# EAGLE design Solenoid Driver - Single (EAGLE 8.7.0)
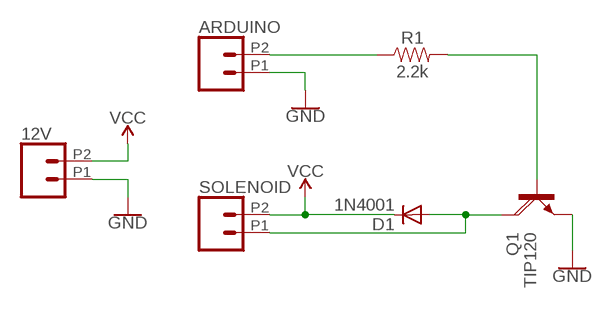
[diagram p0: schematic, sheet 1]

## Parts
12V  CONN_022.54MM_SCREWTERM  [1X02_2.54_SCREWTERM]
ARDUINO  CONN_022.54MM_SCREWTERM  [1X02_2.54_SCREWTERM]
D1  1N4001  1N4004  [DO41-10]
Q1  TIP120  [TO220AH]
R1  2.2k  10KOHM-HORIZ_KIT-1/4W-1%  [AXIAL-0.3-KIT]
SOLENOID  CONN_022.54MM_SCREWTERM  [1X02_2.54_SCREWTERM]

## Nets
GND: 12V.P1 ARDUINO.P1 Q1.E
N$1: Q1.B R1.P$2
N$2: ARDUINO.P2 R1.P$1
N$3: D1.A Q1.C SOLENOID.P1
VCC: 12V.P2 D1.C SOLENOID.P2

## Library data of the parts
12V ARDUINO SOLENOID = SparkFun-Connectors:CONN_02: Multi connection point. Often used as Generic Header-pin footprint for 0.1 inch spaced/style header connections On any of the 0.1 inch spaced packages, you can populate with these: Break Away Headers - Straight <https://www.sparkfun.com/products/116> (PRT-00116) Break Away Male Headers - Right Angle <https://www.sparkfun.com/products/553> (PRT-00553) Female Headers <https://www.sparkfun.com/products/115> (PRT-00115) Break Away Headers - Machine Pin <https://www.sparkfun.com/products/117> (PRT-00117) Break Away Female Headers - Swiss Machine Pin <https://www.sparkfun.com/products/743> (PRT-00743) For SCREWTERMINALS and SPRING TERMINALS visit here: Screw Terimnals on SparkFun.com <https://www.sparkfun.com/search/results?term=Screw+Terminals> (5mm/3.5mm/2.54mm spacing) This device is also useful as a general connection point to wire up your design to another part of your project. Our various solder wires solder well into these plated through hole pads. Hook-Up Wire - Assortment (Stranded, 22 AWG) <https://www.sparkfun.com/products/11375> (PRT-11375) Hook-Up Wire - Assortment (Solid Core, 22 AWG) <https://www.sparkfun.com/products/11367> (PRT-11367) View the entire wire category on our website here <https://www.sparkfun.com/categories/141> Special notes: Molex polarized connector foot print use with: PRT-08233 with associated crimp pins and housings. 2.54_SCREWTERM for use with PRT-10571. 3.5mm Screw Terminal footprints for PRT-08084 5mm Screw Terminal footprints for use with PRT-08432
D1 = adafruit:1N4004: DIODE General purpose 1N400x type rectifier (With bigger pads) http://www.ladyada.net/library/pcb/eaglelibrary.html
Q1 = transistor-power:TIP120: NPN DARLINGTON TRANSISTOR
R1 = SparkFun-Resistors:10KOHM: 10kΩ resistor A resistor is a passive two-terminal electrical component that implements electrical resistance as a circuit element. Resistors act to reduce current flow, and, at the same time, act to lower voltage levels within circuits. - Wikipedia; PROD_ID: RES-12183; VALUE: 10k

## Board
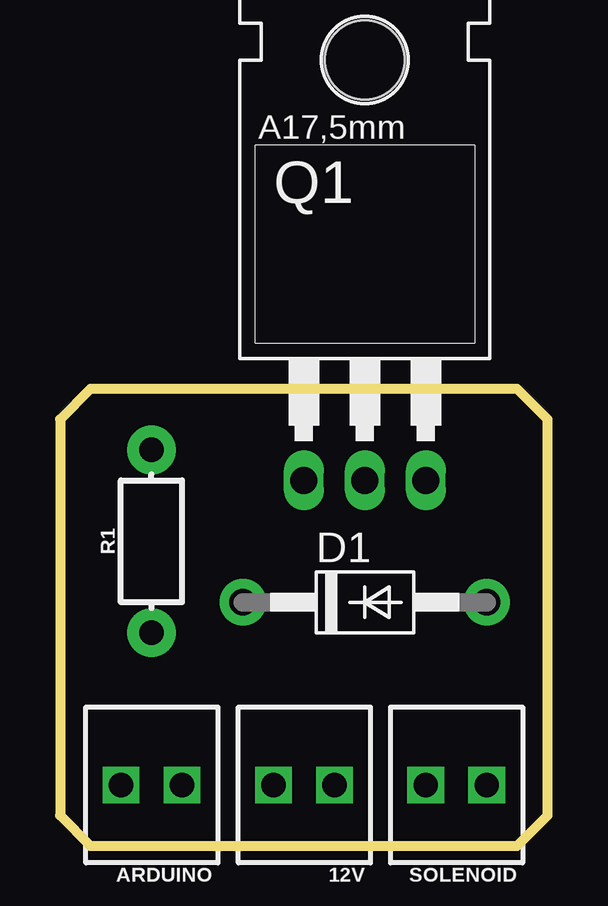
[diagram p1: board, top side]
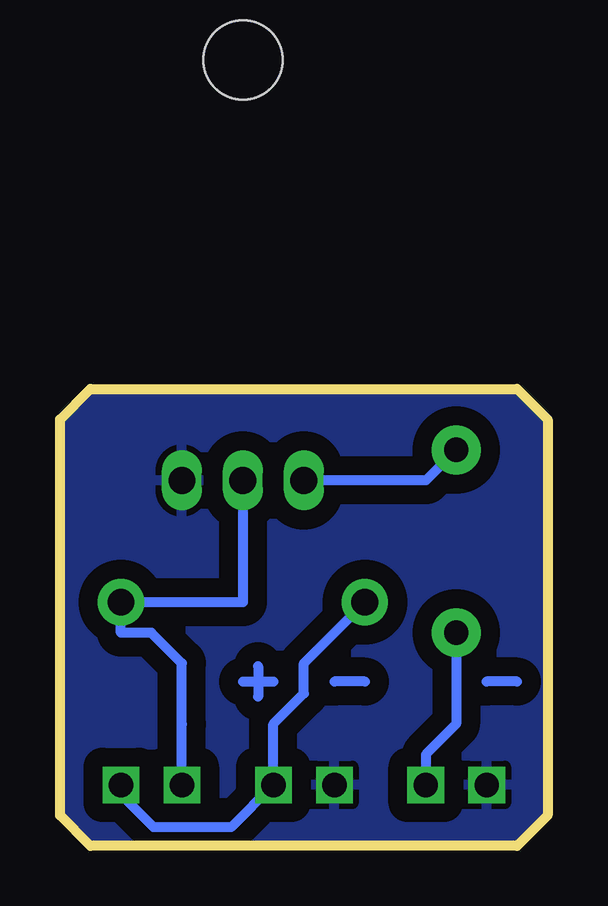
[diagram p2: board, bottom side, seen from below]

Size 20.32 x 19.05 mm. Coordinates in mm from the lower left corner, seen from the top.
Outline: 0,17.78 0,1.27 1.27,0 19.05,0 20.32,1.27 20.32,17.78 19.05,19.05 1.27,19.05 0,17.78
Copper layers (1*16): Top 0.035mm / dielectric 1.5mm / Bottom 0.035mm
Design rules "OthermillDRC_1_32_v2": minimum track width 8mil, minimum drill 0.8mm, track to track 0.794003125mm, track to pad 0.794003125mm, pad to pad 0.794003125mm, via to via 0.794003125mm, smd to smd 0mil, copper to edge 0mil, drill to drill 1mil, minimum pad ring 10mil, minimum via ring 10mil, stop-mask expansion 1mil, vias tented up to drill 30mil, thermal gap 10mil

### Footprints (pad centres in the part's own frame; a part is rotated, then mirrored left to right if it is on the bottom)
1X02_2.54_SCREWTERM = drill 1.016 square: P1 2.54,0; P2 0,0
DO41-10 = drill 1.118 pad 1.93: A 5.08,0; C -5.08,0
TO220AH = drill 1.118 long: B -2.54,-6.35; C 0,-6.35; E 2.54,-6.35 | hole 3.302: 0,11.176
AXIAL-0.3-KIT = drill 1.016 pad 2.032: P$1 -3.81,0; P$2 3.81,0

### Placement (x,y rotation side)
12V  11.43,2.54 180 top
ARDUINO  5.08,2.54 180 top
D1  12.7,10.16 0 top
Q1  12.7,21.59 0 top
R1  3.81,12.7 90 top
SOLENOID  17.78,2.54 180 top

### Tracks (layer width: path | path; a pad name or v marks a point on that pad's centre or on a via)
GND
  pour Bottom: 0,17.78 0,1.27 1.27,0 19.05,0 20.32,1.27 20.32,17.78 19.05,19.05 1.27,19.05
N$1
  Bottom 0.406: R1.P$2 5.08,15.24 Q1.B
N$2
  Bottom 0.406: R1.P$1 3.81,5.08 5.08,3.81 ARDUINO.P2
N$3
  Bottom 0.406: Q1.C 12.7,10.16 D1.A 17.78,8.89 16.51,8.89 15.24,7.62 15.24,5.08 SOLENOID.P1
N$4
  Bottom 0.406: 1.27,6.86 2.54,6.86
N$5
  Bottom 0.406: 7.62,6.86 8.89,6.86
N$8
  Bottom 0.406: 12.7,6.86 11.43,6.86
N$9
  Bottom 0.406: 12.06,7.49 12.06,6.22
VCC
  Bottom 0.406: D1.C 10.16,7.62 10.16,6.35 11.43,5.08 12V.P2 13.19,0.78 16.41,0.78 17.78,2.15 SOLENOID.P2